# Altium schematic sheet p05_cpu_3_of_3.SchDoc
size 513 x 386 mm
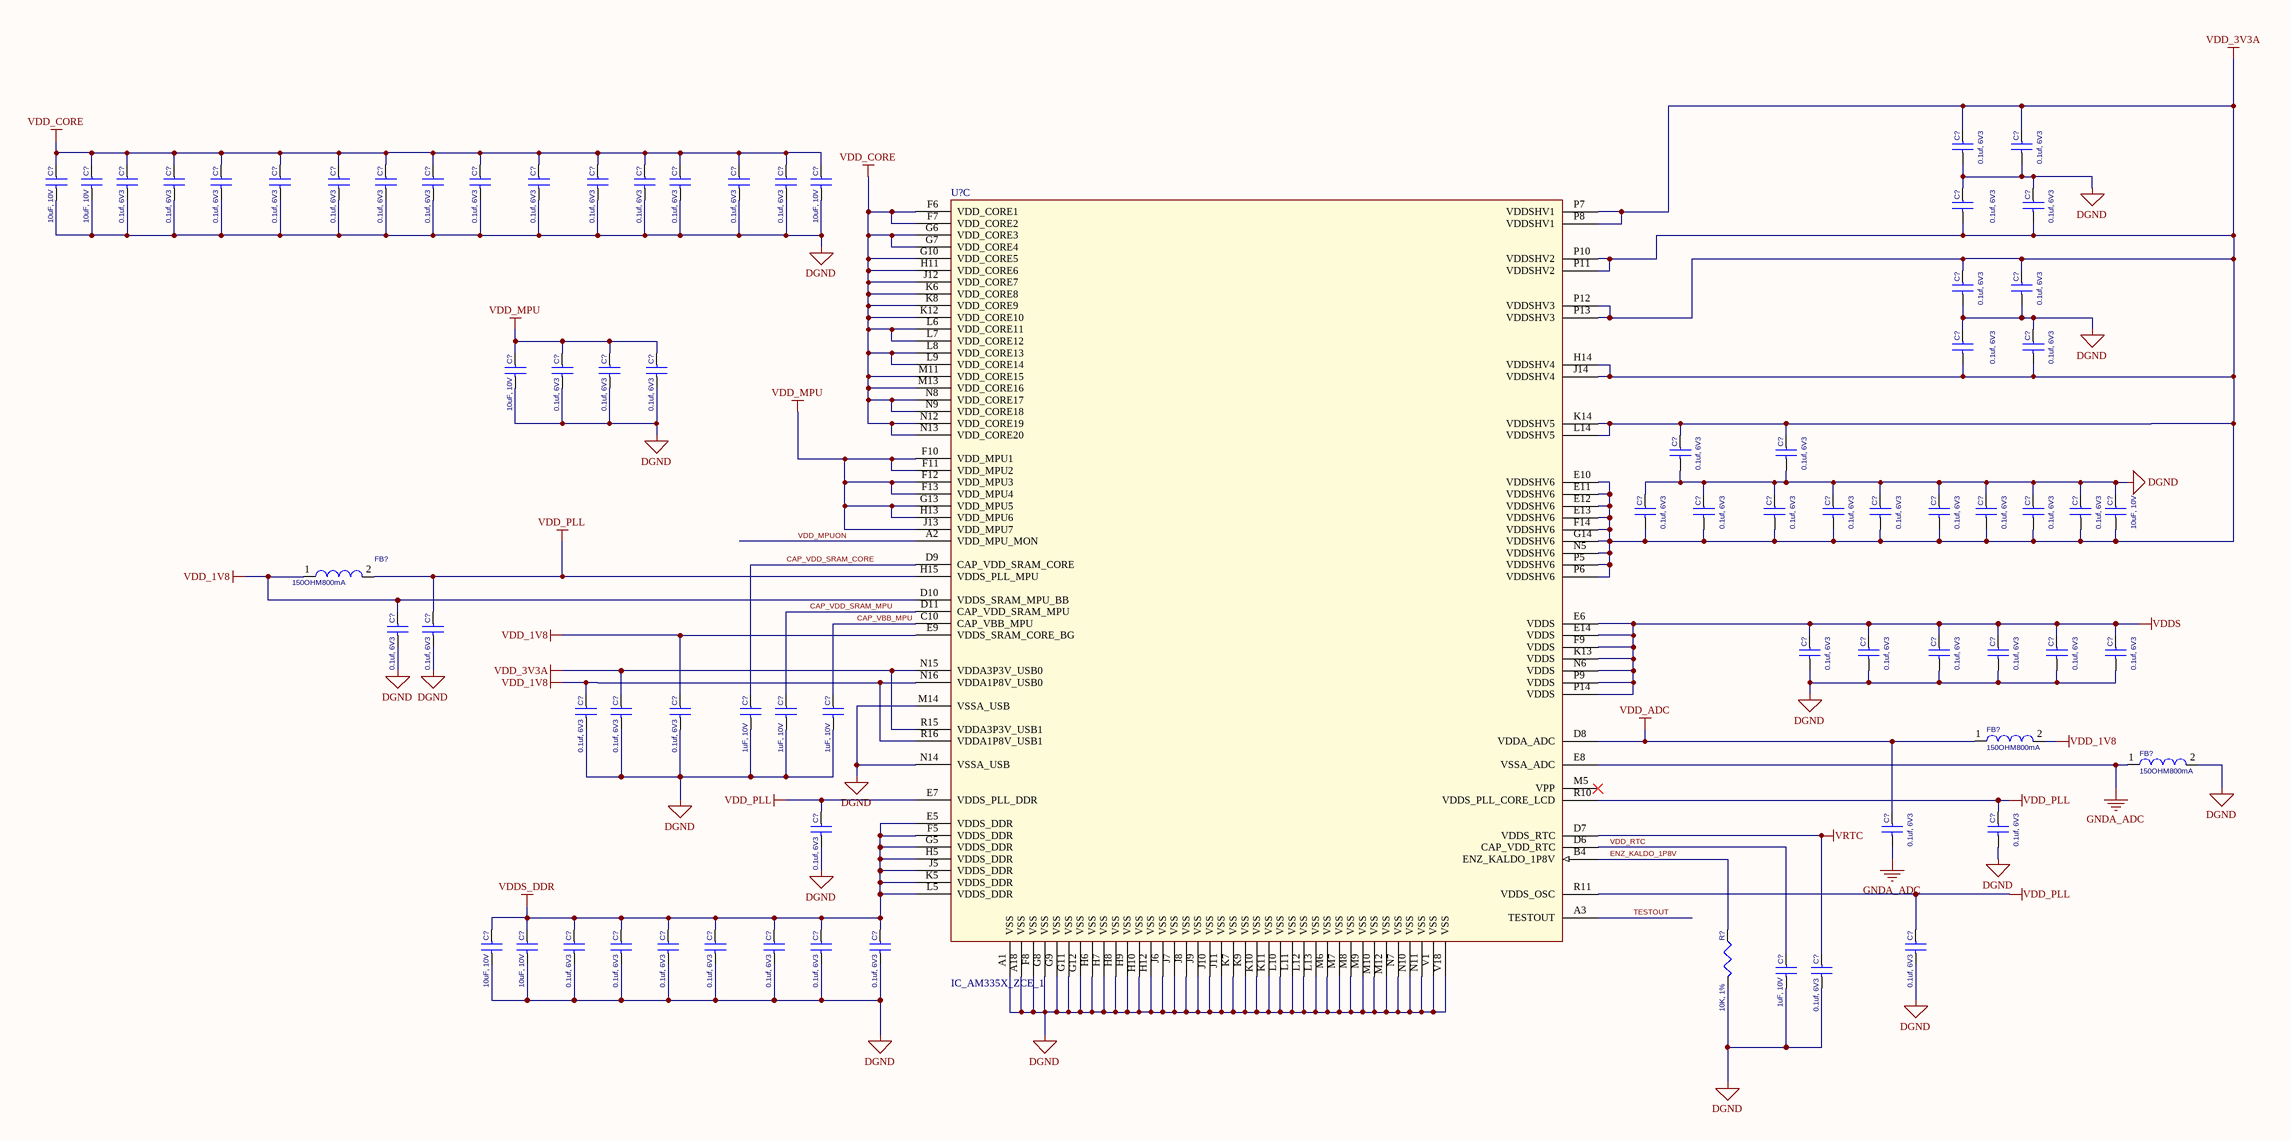
[diagram p0: p05_cpu_3_of_3.SchDoc]

## Parts
(Parts that share a designator on the sheet are numbered #1, #2 ... from top to bottom, then left to right.)
C?#1  0.1uf, 6V3  [402]
C?#2  0.1uf, 6V3  [402]
C?#3  10uF, 10V  [805]
C?#4  10uF, 10V  [805]
C?#5  0.1uf, 6V3  [402]
C?#6  0.1uf, 6V3  [402]
C?#7  0.1uf, 6V3  [402]
C?#8  0.1uf, 6V3  [402]
C?#9  0.1uf, 6V3  [402]
C?#10  0.1uf, 6V3  [402]
C?#11  0.1uf, 6V3  [402]
C?#12  0.1uf, 6V3  [402]
C?#13  0.1uf, 6V3  [402]
C?#14  0.1uf, 6V3  [402]
C?#15  0.1uf, 6V3  [402]
C?#16  0.1uf, 6V3  [402]
C?#17  0.1uf, 6V3  [402]
C?#18  0.1uf, 6V3  [402]
C?#19  10uF, 10V  [805]
C?#20  0.1uf, 6V3  [402]
C?#21  0.1uf, 6V3  [402]
C?#22  0.1uf, 6V3  [402]
C?#23  0.1uf, 6V3  [402]
C?#24  0.1uf, 6V3  [402]
C?#25  0.1uf, 6V3  [402]
C?#26  10uF, 10V  [805]
C?#27  0.1uf, 6V3  [402]
C?#28  0.1uf, 6V3  [402]
C?#29  0.1uf, 6V3  [402]
C?#30  0.1uf, 6V3  [402]
C?#31  0.1uf, 6V3  [402]
C?#32  0.1uf, 6V3  [402]
C?#33  0.1uf, 6V3  [402]
C?#34  0.1uf, 6V3  [402]
C?#35  0.1uf, 6V3  [402]
C?#36  0.1uf, 6V3  [402]
C?#37  0.1uf, 6V3  [402]
C?#38  0.1uf, 6V3  [402]
C?#39  0.1uf, 6V3  [402]
C?#40  0.1uf, 6V3  [402]
C?#41  10uF, 10V  [805]
C?#42  0.1uf, 6V3  [402]
C?#43  0.1uf, 6V3  [402]
C?#44  0.1uf, 6V3  [402]
C?#45  0.1uf, 6V3  [402]
C?#46  0.1uf, 6V3  [402]
C?#47  0.1uf, 6V3  [402]
C?#48  0.1uf, 6V3  [402]
C?#49  0.1uf, 6V3  [402]
C?#50  0.1uf, 6V3  [402]
C?#51  0.1uf, 6V3  [402]
C?#52  0.1uf, 6V3  [402]
C?#53  1uF, 10V  [402]
C?#54  1uF, 10V  [402]
C?#55  1uF, 10V  [402]
C?#56  0.1uf, 6V3  [402]
C?#57  0.1uf, 6V3  [402]
C?#58  0.1uf, 6V3  [402]
C?#59  10uF, 10V  [805]
C?#60  10uF, 10V  [805]
C?#61  0.1uf, 6V3  [402]
C?#62  0.1uf, 6V3  [402]
C?#63  0.1uf, 6V3  [402]
C?#64  0.1uf, 6V3  [402]
C?#65  0.1uf, 6V3  [402]
C?#66  0.1uf, 6V3  [402]
C?#67  0.1uf, 6V3  [402]
C?#68  0.1uf, 6V3  [402]
C?#69  1uF, 10V  [402]
C?#70  0.1uf, 6V3  [402]
FB?#1  150OHM800mA  [SM-7351-IND-0805]
FB?#2  150OHM800mA  [SM-7351-IND-0805]
FB?#3  150OHM800mA  [SM-7351-IND-0805]
R?  10K, 1%  [402]
U?  IC_AM335X_ZCE_1  [am33xx_15x15]  (part C of 3)

## Nets
DGND: C?#1.2 C?#2.2 C?#3.2 C?#4.2 C?#5.2 C?#6.2 C?#7.2 C?#8.2 C?#9.2 C?#10.2 C?#11.2 C?#12.2 C?#13.2 C?#14.2 C?#15.2 C?#16.2 C?#17.2 C?#18.2 C?#19.2 C?#20.1 C?#21.1 C?#22.2 C?#23.2 C?#24.1 C?#25.1 C?#26.2 C?#27.2 C?#28.2 C?#29.2 C?#30.2 C?#31.2 C?#32.1 C?#33.1 C?#34.1 C?#35.1 C?#36.1 C?#37.1 C?#38.1 C?#39.1 C?#40.1 C?#41.1 C?#42.2 C?#43.2 C?#44.2 C?#45.2 C?#46.2 C?#47.2 C?#48.2 C?#49.2 C?#50.2 C?#51.2 C?#52.2 C?#53.2 C?#54.2 C?#55.2 C?#56.2 C?#58.2 C?#59.2 C?#60.2 C?#61.2 C?#62.2 C?#63.2 C?#64.2 C?#65.2 C?#66.2 C?#67.2 C?#68.2 C?#69.2 C?#70.2 FB?#3.2 R?.2 U?.A1(VSS) U?.A18(VSS) U?.F8(VSS) U?.G8(VSS) U?.G9(VSS) U?.G11(VSS) U?.G12(VSS) U?.H6(VSS) U?.H7(VSS) U?.H8(VSS) U?.H9(VSS) U?.H10(VSS) U?.H12(VSS) U?.J6(VSS) U?.J7(VSS) U?.J8(VSS) U?.J9(VSS) U?.J10(VSS) U?.J11(VSS) U?.K7(VSS) U?.K9(VSS) U?.K10(VSS) U?.K11(VSS) U?.L10(VSS) U?.L11(VSS) U?.L12(VSS) U?.L13(VSS) U?.M6(VSS) U?.M7(VSS) U?.M8(VSS) U?.M9(VSS) U?.M10(VSS) U?.M12(VSS) U?.M14(VSSA_USB) U?.N7(VSS) U?.N10(VSS) U?.N11(VSS) U?.N14(VSSA_USB) U?.V1(VSS) U?.V18(VSS)
GNDA_ADC: C?#57.2 FB?#3.1 U?.E8(VSSA_ADC)
VDD_1V8: C?#42.1 C?#50.1 C?#52.1 FB?#1.1 FB?#2.2 U?.D10(VDDS_SRAM_MPU_BB) U?.E9(VDDS_SRAM_CORE_BG) U?.N16(VDDA1P8V_USB0) U?.R16(VDDA1P8V_USB1)
VDD_3V3A: C?#1.1 C?#2.1 C?#20.2 C?#21.2 C?#22.1 C?#23.1 C?#24.2 C?#25.2 C?#30.1 C?#31.1 C?#32.2 C?#33.2 C?#34.2 C?#35.2 C?#36.2 C?#37.2 C?#38.2 C?#39.2 C?#40.2 C?#41.2 C?#51.1 U?.E10(VDDSHV6) U?.E11(VDDSHV6) U?.E12(VDDSHV6) U?.E13(VDDSHV6) U?.F14(VDDSHV6) U?.G14(VDDSHV6) U?.H14(VDDSHV4) U?.J14(VDDSHV4) U?.K14(VDDSHV5) U?.L14(VDDSHV5) U?.N5(VDDSHV6) U?.N15(VDDA3P3V_USB0) U?.P5(VDDSHV6) U?.P6(VDDSHV6) U?.P7(VDDSHV1) U?.P8(VDDSHV1) U?.P10(VDDSHV2) U?.P11(VDDSHV2) U?.P12(VDDSHV3) U?.P13(VDDSHV3) U?.R15(VDDA3P3V_USB1)
VDD_ADC: C?#57.1 FB?#2.1 U?.D8(VDDA_ADC)
VDD_CORE: C?#3.1 C?#4.1 C?#5.1 C?#6.1 C?#7.1 C?#8.1 C?#9.1 C?#10.1 C?#11.1 C?#12.1 C?#13.1 C?#14.1 C?#15.1 C?#16.1 C?#17.1 C?#18.1 C?#19.1 U?.F6(VDD_CORE1) U?.F7(VDD_CORE2) U?.G6(VDD_CORE3) U?.G7(VDD_CORE4) U?.G10(VDD_CORE5) U?.H11(VDD_CORE6) U?.J12(VDD_CORE7) U?.K6(VDD_CORE8) U?.K8(VDD_CORE9) U?.K12(VDD_CORE10) U?.L6(VDD_CORE11) U?.L7(VDD_CORE12) U?.L8(VDD_CORE13) U?.L9(VDD_CORE14) U?.M11(VDD_CORE15) U?.M13(VDD_CORE16) U?.N8(VDD_CORE17) U?.N9(VDD_CORE18) U?.N12(VDD_CORE19) U?.N13(VDD_CORE20)
VDD_MPU: C?#26.1 C?#27.1 C?#28.1 C?#29.1 U?.F10(VDD_MPU1) U?.F11(VDD_MPU2) U?.F12(VDD_MPU3) U?.F13(VDD_MPU4) U?.G13(VDD_MPU5) U?.H13(VDD_MPU6) U?.J13(VDD_MPU7)
VDD_PLL: C?#43.1 C?#56.1 C?#58.1 C?#68.1 FB?#1.2 U?.E7(VDDS_PLL_DDR) U?.H15(VDDS_PLL_MPU) U?.R10(VDDS_PLL_CORE_LCD) U?.R11(VDDS_OSC)
VDDS: C?#44.1 C?#45.1 C?#46.1 C?#47.1 C?#48.1 C?#49.1 U?.E6(VDDS) U?.E14(VDDS) U?.F9(VDDS) U?.K13(VDDS) U?.N6(VDDS) U?.P9(VDDS) U?.P14(VDDS)
VDDS_DDR: C?#59.1 C?#60.1 C?#61.1 C?#62.1 C?#63.1 C?#64.1 C?#65.1 C?#66.1 C?#67.1 U?.E5(VDDS_DDR) U?.F5(VDDS_DDR) U?.G5(VDDS_DDR) U?.H5(VDDS_DDR) U?.J5(VDDS_DDR) U?.K5(VDDS_DDR) U?.L5(VDDS_DDR)
VRTC: C?#70.1 U?.D7(VDDS_RTC)
CAP_VBB_MPU: C?#55.1 U?.C10(CAP_VBB_MPU)
CAP_VDD_SRAM_CORE: C?#53.1 U?.D9(CAP_VDD_SRAM_CORE)
CAP_VDD_SRAM_MPU: C?#54.1 U?.D11(CAP_VDD_SRAM_MPU)
ENZ_KALDO_1P8V: R?.1 U?.B4(ENZ_KALDO_1P8V)
TESTOUT: U?.A3(TESTOUT)
VDD_MPUON: U?.A2(VDD_MPU_MON)
VDD_RTC: C?#69.1 U?.D6(CAP_VDD_RTC)

Not connected (* = marked no-connect by the designer): U? M5(VPP)*

## Library data of the parts
C?#1 C?#2 C?#5-C?#18 C?#20-C?#25 C?#27-C?#40 C?#42-C?#52 C?#56-C?#58 C?#61-C?#68 C?#70 = CAP_0.1uF_X7R_16V_10% 0402: CAP CER 0.1UF 6.3V 10% X5R 0402; Manufacturer: TDK Corporation; Manufacturer Part Number: C1005X5R0J104K050BA; Capacitance: 0.1µF; Applications: General Purpose; Category: Capacitors; ComponentLink1Description: http://www.kemet.com/datasheets&C0402C104K4RACTU; ComponentLink1URL: http://www.kemet.com/datasheets&C0402C104K4RACTU; Features: -; Height - Seated (Max): -; Lead Spacing: -; Lead Style: -; Mounting Type: Surface Mount, MLCC; Operating Temperature: -55°C ~ 85°C; Package / Case: 0402 (1005 Metric); Packaging: Digi-Reel®; Pricing 1: 1=0.1, 10=0.026, 100=0.0121, 250=0.00992, 500=0.00848, 1000=0.0066, 5000=0.0055 (USD); Ratings: -; RoHS: RoHS Compliant; Size / Dimension: 0.039" L x 0.020" W (1.00mm x 0.50mm); Stock 1: 127604; Supplier 1: Digi-Key; Supplier Part Number 1: 445-1266-6-ND; Temperature Coefficient: X5R; Thickness (Max): 0.022" (0.55mm); Tolerance: ±10%; Voltage - Rated: 6.3V
C?#3 C?#4 C?#19 C?#26 C?#41 C?#59 C?#60 = CAP_10uF_Y5V_10V_10%_0805: CAP CER 10UF 10V Y5V 0805; Manufacturer: TDK Corporation; Manufacturer Part Number: C2012Y5V1A106Z; Capacitance: 10µF; Tolerance: -20%, +80%; Temperature Coefficient: Y5V (F); Supplier 1: Digi-Key; Supplier Part Number 1: 445-1371-6-ND; RoHS: RoHS Compliant; Category: Capacitors; Stock 1: 123307; Pricing 1: 1=0.15, 10=0.105, 100=0.0499, 250=0.042, 500=0.03518, 1000=0.02887 (USD); Voltage - Rated: 10V; Mounting Type: Surface Mount, MLCC; Operating Temperature: -30°C ~ 85°C; Applications: General Purpose; Ratings: -; Package / Case: 0805 (2012 Metric); Size / Dimension: 0.079" L x 0.049" W (2.00mm x 1.25mm); Height - Seated (Max): -; Thickness (Max): 0.057" (1.45mm); Lead Spacing: -; Features: -; Packaging: Digi-Reel®; Lead Style: -; ComponentLink1URL: http://media.digikey.com/pdf/Data%20Sheets/TDK%20PDFs/C_Series_GeneralAppl_B11.pdf; ComponentLink1Description: http://media.digikey.com/pdf/Data%20Sheets/TDK%20PDFs/C_Series_GeneralAppl_B11.pdf
C?#53-C?#55 C?#69 = CAP_1.0UF_X5R_10V_10%_0402: CAP CER 1UF 10V 10% X5R 0402; Manufacturer: AVX Corporation; Manufacturer Part Number: 0402ZD105KAT2A; Capacitance: 1.0µF; Applications: General Purpose; Category: Capacitors; ComponentLink1Description: http://www.avx.com/docs/Catalogs/cx5r.pdf; ComponentLink1URL: http://www.avx.com/docs/Catalogs/cx5r.pdf; Features: -; Height - Seated (Max): -; Lead Spacing: -; Lead Style: -; Mounting Type: Surface Mount, MLCC; Operating Temperature: -55°C ~ 85°C; Package / Case: 0402 (1005 Metric); Packaging: Digi-Reel®; Pricing 1: 1=0.3, 10=0.25, 100=0.125, 250=0.09376, 500=0.08282, 1000=0.07344, 5000=0.06094 (USD); Ratings: -; RoHS: RoHS Compliant; Size / Dimension: 0.039" L x 0.020" W (1.00mm x 0.50mm); Stock 1: 409277; Supplier 1: Digi-Key; Supplier Part Number 1: 478-4596-6-ND; Temperature Coefficient: X5R; Thickness (Max): 0.022" (0.56mm); Tolerance: ±10%; Voltage - Rated: 10V
FB?#1-FB?#3 = FER_180_200_0: FERRITE 800MA 150 OHM 0805 SMD; PartName: FerriteBead150ohm800mA; Mfr: Steward; MfrNum: LI0805H151R-10; TIIntPartnumber: 1L0010; Manufacturer: Laird-Signal Integrity Products; Vendor: Digikey; Impedance @ Frequency: 150 Ohm @ 100MHz; DC Resistance (DCR): 150 mOhm Max; Filter Type: Differential Mode - Single; Supplier 1: Digi-Key; Supplier Part Number 1: 240-2384-6-ND; Manufacturer Part Number: LI0805H151R-10; RoHS: RoHS Compliant; Category: Filters; Stock 1: 3694; Pricing 1: 1=0.1, 10=0.07, 25=0.064, 50=0.0574, 100=0.0421, 250=0.03064, 500=0.02808, 1000=0.02424 (USD); Current Rating: 800mA; Package / Case: 0805 (2012 Metric); Mounting Type: Surface Mount; Packaging: Digi-Reel®; Height (Max): 0.043" (1.10mm); Size / Dimension: 0.079" L x 0.049" W (2.00mm x 1.25mm); ComponentLink1URL: http://www.lairdtech.com/WorkArea/linkit.aspx?LinkIdentifier=id&ItemID=4912; ComponentLink1Description: http://www.lairdtech.com/WorkArea/linkit.aspx?LinkIdentifier=id&ItemID=4912
R? = RES_10K_1/16W_1%_0402: RES 10K OHM 1/16W 5% 0402 SMD; Manufacturer: Rohm Semiconductor; Manufacturer Part Number: MCR01MZPJ103; Power (Watts): 0.063W, 1/16W; Temperature Coefficient: ±200ppm/°C; Supplier 1: Digi-Key; Supplier Part Number 1: RHM10KJDKR-ND; RoHS: RoHS Compliant; Category: Resistors; Stock 1: 110842; Pricing 1: 1=0.1, 10=0.019, 25=0.014, 100=0.0078, 250=0.00596, 500=0.00476, 1000=0.0035, 5000=0.00251 (USD); Resistance (Ohms): 10k; Composition: Thick Film; Features: Automotive AEC-Q200 Qualified; Tolerance: ±5%; Package / Case: 0402 (1005 Metric); Supplier Device Package: 0402 (1005 Metric); Size / Dimension: 0.039" L x 0.020" W (1.00mm x 0.50mm); Height: 0.016" (0.40mm); Number of Terminations: 2; Packaging: Digi-Reel®; ComponentLink1URL: http://rohmfs.rohm.com/en/products/databook/datasheet/passive/resistor/chip_resistor/mcr_a.pdf; ComponentLink1Description: http://rohmfs.rohm.com/en/products/databook/datasheet/passive/resistor/chip_resistor/mcr_a.pdf
U? = IC_AM335X_ZCE_1: SubArctic Cortex A8 Processor 15x15; Manufacturer: Texas Instruments; Manufacturer Part Number: XAM3359ZCZ; Processor Type: ARM Microprocessor; Voltage: 1.06 V ~ 1.15 V; Supplier 1: Digi-Key; Supplier Part Number 1: 296-35073-ND; RoHS: RoHS Compliant; Category: Integrated Circuits (ICs); Stock 1: 16; Pricing 1: 1=33.5, 10=30.988, 100=26.465, 250=24.28752, 500=23.115, 1000=21.775, 2500=21.105, 5000=20.6025, 10000=20.1 (USD); Features: -; Speed: -; Mounting Type: Surface Mount; Package / Case: 324-LFBGA; Supplier Device Package: 324-NFBGA(15x15); Packaging: Tray; ComponentLink1URL: http://www.ti.com/lit/ds/symlink/am3354.pdf; ComponentLink1Description: http://www.ti.com/lit/ds/symlink/am3354.pdf